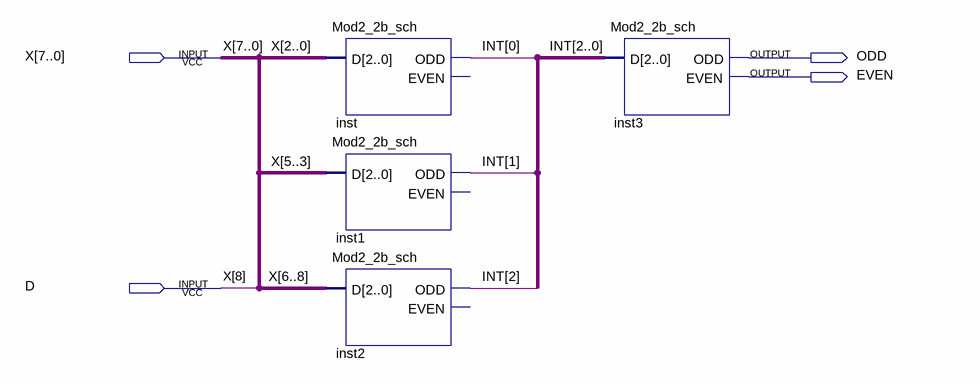
[diagram p0: schematic sheet]
// Quartus schematic Mod2_8b_sch.bdf as structural Verilog: 4 symbols, 4 pins
module Mod2_8b_sch (
  input  [7:0] X,
  input  D,
  output ODD,
  output EVEN
);

  wire [2:0] INT;

  Mod2_2b_sch inst (.D(X[2:0]), .ODD(INT[0]));  // open: EVEN
  Mod2_2b_sch inst1 (.D(X[5:3]), .ODD(INT[1]));  // open: EVEN
  Mod2_2b_sch inst2 (.D({X[6], X[7], D}), .ODD(INT[2]));  // open: EVEN
  Mod2_2b_sch inst3 (.D(INT), .ODD(ODD), .EVEN(EVEN));

  // Other names for the same wires on the sheet: X[8] = D
endmodule
